# Altium schematic sheet analog_pwr.SchDoc
size A4
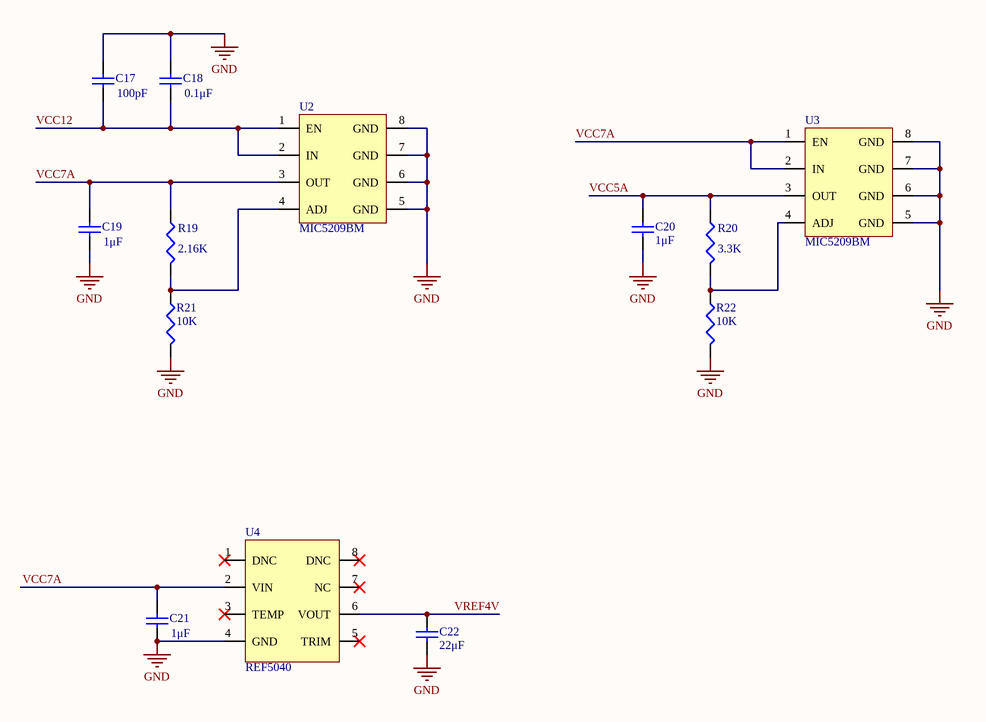
[diagram p0: analog_pwr.SchDoc]

## Parts
C17  value 100pF  [1608[0603]]  (hidden comment: Cap Semi)
C18  value 0.1μF  [1608[0603]]  (hidden comment: Cap Semi)
C19  value 1μF  [1608[0603]]  (hidden comment: Cap Semi)
C20  value 1μF  [1608[0603]]  (hidden comment: Cap Semi)
C21  value 1μF  [1608[0603]]  (hidden comment: Cap Semi)
C22  value 22μF  [1608[0603]]  (hidden comment: Cap Semi)
R19  value 2.16K  [J1-0603]  (hidden comment: Res3)
R20  value 3.3K  [J1-0603]  (hidden comment: Res3)
R21  value 10K  [J1-0603]  (hidden comment: Res3)
R22  value 10K  [J1-0603]  (hidden comment: Res3)
U2  MIC5209BM  [SOIC127P600X175-8N]
U3  MIC5209BM  [SOIC127P600X175-8N]
U4  REF5040  [SOIC127P600X175-8N]

## Nets
GND: C17.2 C18.2 C19.1 C20.1 C21.1 C22.1 R21.2 R22.2 U2.5(GND) U2.6(GND) U2.7(GND) U2.8(GND) U3.5(GND) U3.6(GND) U3.7(GND) U3.8(GND) U4.4(GND)
VCC5A: C20.2 R20.1 U3.3(OUT)
VCC7A: C19.2 C21.2 R19.1 U2.3(OUT) U3.1(EN) U3.2(IN) U4.2(VIN)
VCC12: C17.1 C18.1 U2.1(EN) U2.2(IN)
VREF4V: C22.2 U4.6(VOUT)
NetR19_2: R19.2 R21.1 U2.4(ADJ)
NetR20_2: R20.2 R22.1 U3.4(ADJ)

Not connected (* = marked no-connect by the designer): U4 1(DNC)* 3(TEMP)* 5(TRIM)* 7(NC)* 8(DNC)*

## Library data of the parts
C17-C22 = Cap Semi: Capacitor (Semiconductor SIM Model); Published: 8-Jun-2000; LatestRevisionDate: 29-May-2009; LatestRevisionNote: IPC-7351 Footprint Added.; PackageReference: C1206; Publisher: Altium Limited; PackageDescription: Chip Capacitor
R19-R22 = Res3: Resistor; Published: 8-Jun-2000; LatestRevisionDate: 29-May-2009; LatestRevisionNote: IPC-7351 Footprint Added.; PackageReference: J1-0603; Publisher: Altium Limited; PackageDescription: Chip Resistor